# Altium schematic sheet Headers.SchDoc
size A; SheetNumber: 1; SheetTotal: 1
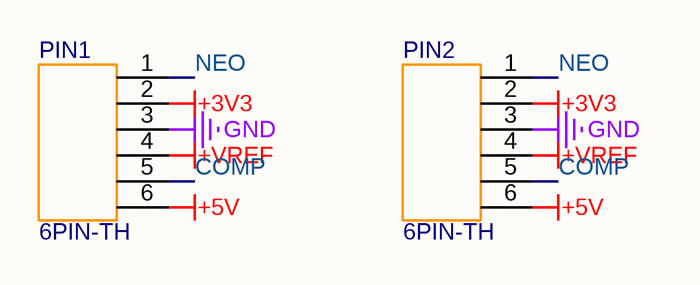
[diagram p0: Headers.SchDoc]

## Parts
PIN1  6PIN-TH  [6PIN-TH]
PIN2  6PIN-TH  [6PIN-TH]

## Nets
+3V3: PIN1.2 PIN2.2
+5V: PIN1.6 PIN2.6
+VREF: PIN1.4 PIN2.4
GND: PIN1.3 PIN2.3
COMP: PIN1.5 PIN2.5
NEO: PIN1.1 PIN2.1